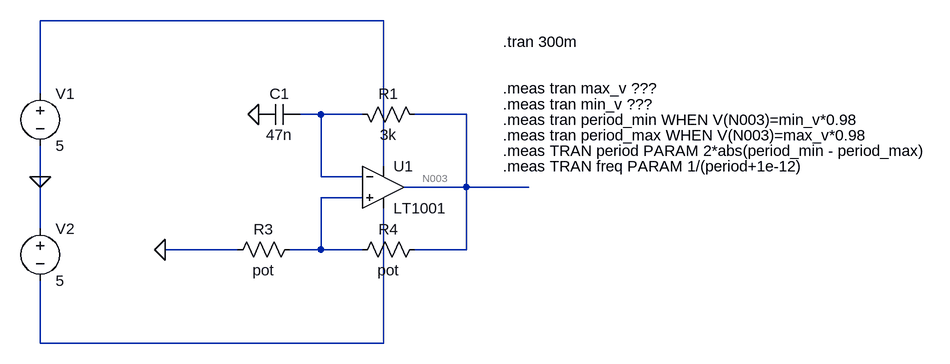
[diagram p0: schematic ex6.asc]
ex6.asc, the LTspice schematic file:
Version 4
SHEET 1 880 680
WIRE -48 -272 -576 -272
WIRE -576 -160 -576 -272
WIRE -144 -128 -176 -128
WIRE -80 -128 -144 -128
WIRE 80 -128 0 -128
WIRE -48 -48 -48 -272
WIRE -576 -32 -576 -80
WIRE -144 -32 -144 -128
WIRE -80 -32 -144 -32
WIRE 80 -16 80 -128
WIRE 80 -16 -16 -16
WIRE 176 -16 80 -16
WIRE -80 0 -144 0
WIRE -576 48 -576 -32
WIRE -272 80 -384 80
WIRE -144 80 -144 0
WIRE -144 80 -192 80
WIRE -80 80 -144 80
WIRE 80 80 80 -16
WIRE 80 80 0 80
WIRE -576 224 -576 128
WIRE -48 224 -48 16
WIRE -48 224 -576 224
FLAG -240 -128 0
FLAG -576 -32 0
FLAG -384 80 0
SYMBOL Opamps\\LT1001 -48 -80 R0
SYMATTR InstName U1
SYMBOL voltage -576 -176 R0
WINDOW 123 0 0 Left 2
WINDOW 39 0 0 Left 2
SYMATTR InstName V1
SYMATTR Value 5
SYMBOL res -288 96 R270
WINDOW 0 32 56 VTop 2
WINDOW 3 0 56 VBottom 2
SYMATTR InstName R3
SYMATTR Value pot
SYMBOL res -96 96 R270
WINDOW 0 32 56 VTop 2
WINDOW 3 0 56 VBottom 2
SYMATTR InstName R4
SYMATTR Value pot
SYMBOL res -96 -144 M90
WINDOW 0 0 56 VBottom 2
WINDOW 3 32 56 VTop 2
SYMATTR InstName R1
SYMATTR Value 3k
SYMBOL cap -176 -112 M270
WINDOW 0 32 32 VTop 2
WINDOW 3 0 32 VBottom 2
SYMATTR InstName C1
SYMATTR Value 47n
SYMBOL voltage -576 32 R0
WINDOW 123 0 0 Left 2
WINDOW 39 0 0 Left 2
SYMATTR InstName V2
SYMATTR Value 5
TEXT 136 -240 Left 2 !.tran 300m
TEXT 136 -96 Left 2 !.meas tran period_max WHEN V(N003)=max_v*0.98
TEXT 136 -168 Left 2 !.meas tran max_v ???
TEXT 136 -144 Left 2 !.meas tran min_v ???
TEXT 136 -120 Left 2 !.meas tran period_min WHEN V(N003)=min_v*0.98
TEXT 136 -72 Left 2 !.meas TRAN period PARAM 2*abs(period_min - period_max)
TEXT 136 -48 Left 2 !.meas TRAN freq PARAM 1/(period+1e-12)

The netlist it stands for:
* ex6.asc
XU1 N004 N002 N001 N005 N003 LT1001  ; pins In+ In- V+ V- OUT
V1 N001 0 5
R3 0 N004 pot
R4 N004 N003 pot
R1 N002 N003 3k
C1 N002 0 47n
V2 0 N005 5
.tran 300m
.meas tran period_max WHEN V(N003)=max_v*0.98
.meas tran max_v ???
.meas tran min_v ???
.meas tran period_min WHEN V(N003)=min_v*0.98
.meas TRAN period PARAM 2*abs(period_min - period_max)
.meas TRAN freq PARAM 1/(period+1e-12)
.lib LTC.lib
.backanno
.end